# Altium schematic sheet 15 MicroSD Card.SchDoc: CM4 IO
size 297 x 209 mm; Page Create Date: March  8, 1995; Page Number: 15; Page Size: A4; Comment: radxa_1010; Page Count: 19; RevCode: V1.10; Doc: 15 MicroSD Card; DsnPath: D:\WMS\黄工\[RC126]CM4_IO_V1.10\[RC126]_V1.10\CM4 IO_V1.10.DSN; SchematicName: CM4 IO V1.10; PageName: 15 MicroSD Card; PageSize: A4; TopSchematic: True
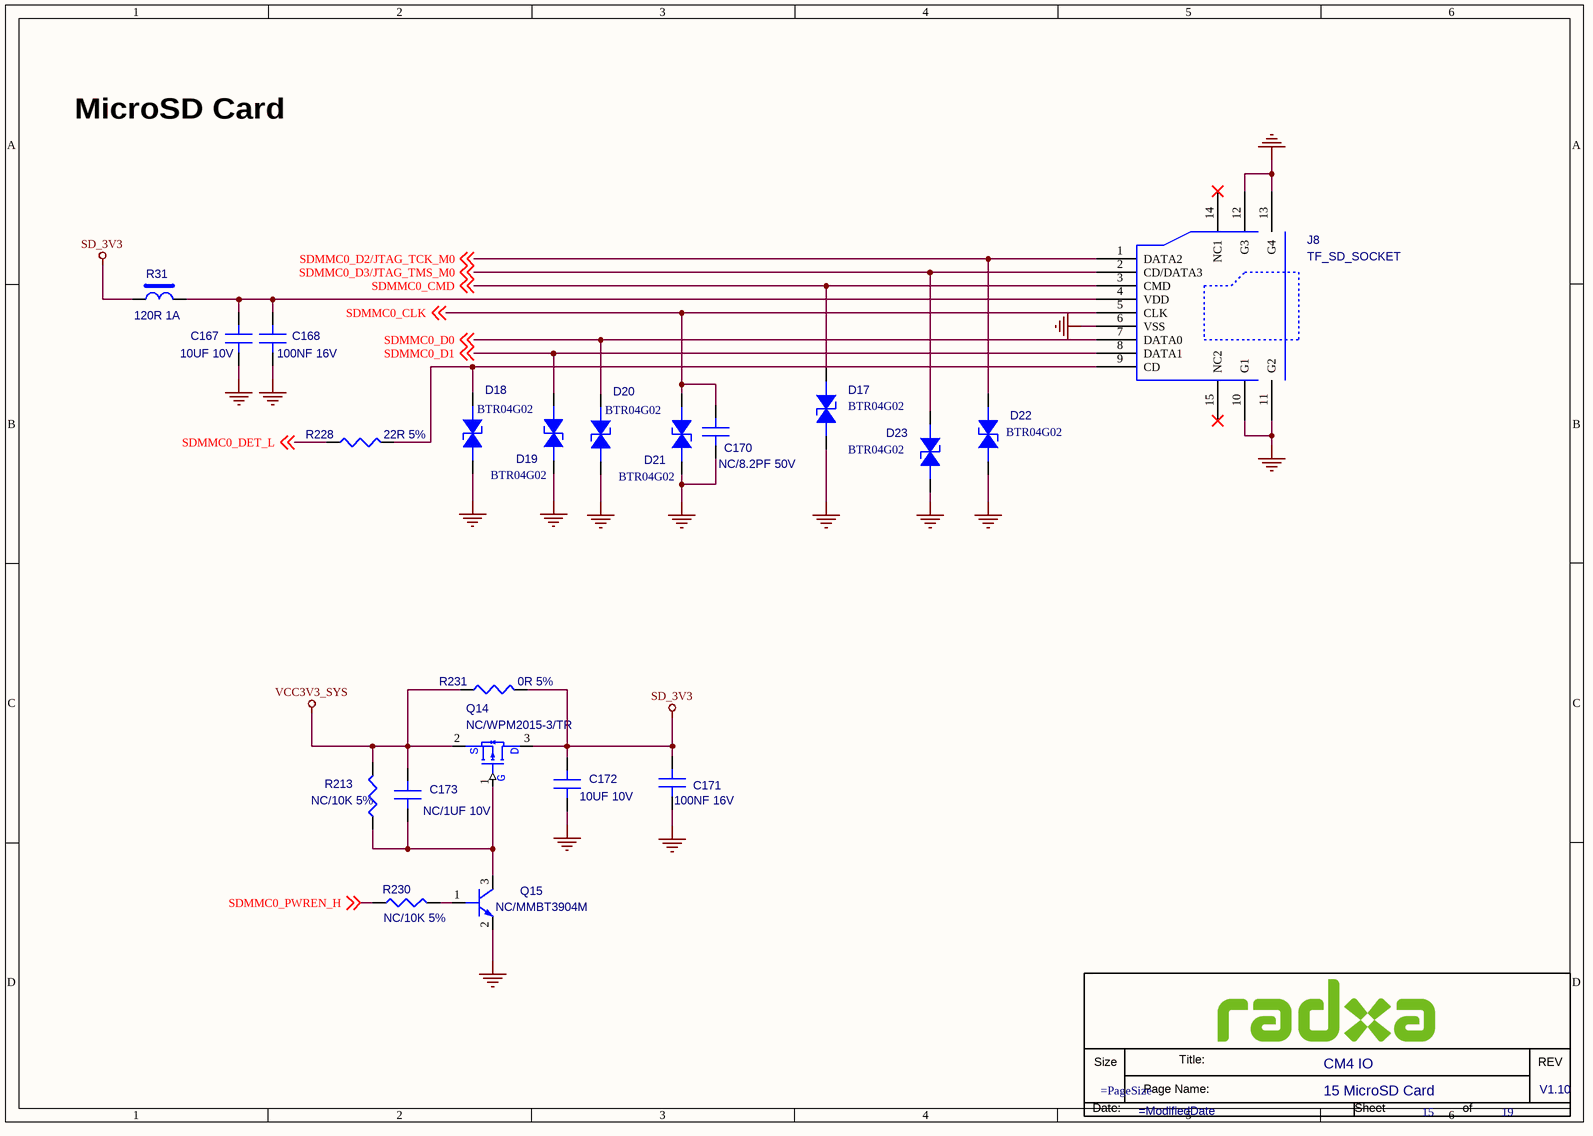
[diagram p0: 15 MicroSD Card.SchDoc]

## Parts
*  Doc: 15 MicroSD Card  RevCode: V1.10  Title: CM4 IO  Page Number: 15  Page Count: 19  (hidden comment: radxa_1010)  (graphical)
C167  10UF 10V  [C0603]
C168  100NF 16V  [C0201]
C170  NC/8.2PF 50V  [C0201]
C171  100NF 16V  [C0201]
C172  10UF 10V  [C0603]
C173  NC/1UF 10V  [C0201]
D17  BTR04G02  [DFN1006-2L]
D18  BTR04G02  [DFN1006-2L]
D19  BTR04G02  [DFN1006-2L]
D20  BTR04G02  [DFN1006-2L]
D21  BTR04G02  [DFN1006-2L]
D22  BTR04G02  [DFN1006-2L]
D23  BTR04G02  [DFN1006-2L]
J8  TF_SD_SOCKET  [SD_SM9_1D1_15D75]
Q14  NC/WPM2015-3/TR  [SOT_23]
Q15  NC/MMBT3904M  [SOT_723]
R31  120R 1A  [FB0201]
R213  NC/10K 5%  [R0402]
R228  22R 5%  [R0402]
R230  NC/10K 5%  [R0402]
R231  0R 5%  [R0402]

## Nets
GND: C167.2(B) C168.2(B) C170.2(B) C171.2(B) C172.2(B) D17.1(ANODE) D18.1(ANODE) D19.1(ANODE) D20.1(ANODE) D21.1(ANODE) D22.1(ANODE) D23.1(ANODE) J8.6(VSS) J8.10(G1) J8.11(G2) J8.12(G3) J8.13(G4) Q15.2(EMITTER)
SD_3V3: C171.1(A) C172.1(A) Q14.3(D) R31.1 R231.2
VCC3V3_SYS: C173.1(A) Q14.2(S) R213.2 R231.1
SDMMC0_CLK: C170.1(A) D21.2(CATHODE) J8.5(CLK) ; off-sheet SDMMC0_CLK
SDMMC0_CMD: D17.2(CATHODE) J8.3(CMD) ; off-sheet SDMMC0_CMD
SDMMC0_D0: D20.2(CATHODE) J8.7(DATA0) ; off-sheet SDMMC0_D0
SDMMC0_D1: D19.2(CATHODE) J8.8(DATA1) ; off-sheet SDMMC0_D1
SDMMC0_D2/JTAG_TCK_M0: D22.2(CATHODE) J8.1(DATA2) ; off-sheet SDMMC0_D2/JTAG_TCK_M0
SDMMC0_D3/JTAG_TMS_M0: D23.2(CATHODE) J8.2(CD/DATA3) ; off-sheet SDMMC0_D3/JTAG_TMS_M0
SDMMC0_DET_L: R228.1 ; off-sheet SDMMC0_DET_L
SDMMC0_PWREN_H: R230.1 ; off-sheet SDMMC0_PWREN_H
NetC167_1: C167.1(A) C168.1(A) J8.4(VDD) R31.2
NetC173_2: C173.2(B) Q14.1(G) Q15.3(COLLECTOR) R213.1
NetD18_2: D18.2(CATHODE) J8.9(CD) R228.2
NetQ15_1: Q15.1(BASE) R230.2

Not connected (* = marked no-connect by the designer): J8 14(NC1)* 15(NC2)*

## Notes on the sheet
- MicroSD Card
- (in symbol radxa_1010) Size; Title:; REV; Page Name:; Date:; Sheet; of

## Library data of the parts
C167 = C: SMD  0603  10UF  10V  X5R  ±10%  ROHS; PARTS: 1; Part Reference: C167; Part Number: A1C01.00270; OriginalSymbolOrigin: (0,30); PKG_TYPE: CAP2-100-250; LEVEL: STD; PINSWAP: (A,B); Value: 10UF 10V; Part Type: 陶瓷电容; PCB Footprint: C0603
C168 = C: SMD  0201  100NF  16V  X5R  ±20%  ROHS; PARTS: 1; Part Reference: C168; Part Number: A1C01.00099; OriginalSymbolOrigin: (0,30); PKG_TYPE: CAP2-100-250; LEVEL: STD; PINSWAP: (A,B); Preferred: 6715f349cd0bc5; Value: 100NF 16V; Part Type: 陶瓷电容
C170 = C: SMD  0201  8.2PF  50V  NPO  ±5%  ROHS; PARTS: 1; Part Reference: C170; Part Number: A1C01.00147; OriginalSymbolOrigin: (0,30); PKG_TYPE: CAP2-100-250; LEVEL: STD; PINSWAP: (A,B); Value: NC/8.2PF 50V; Part Type: 陶瓷电容; PCB Footprint: C0201
C171 = C: SMD  0201  100NF  16V  X5R  ±20%  ROHS; PARTS: 1; Part Reference: C171; Part Number: A1C01.00099; OriginalSymbolOrigin: (0,30); PKG_TYPE: CAP2-100-250; LEVEL: STD; PINSWAP: (A,B); Preferred: 6715f349cd0bc5; Value: 100NF 16V; Part Type: 陶瓷电容
C172 = C: SMD  0603  10UF  10V  X5R  ±20%  ROHS; PARTS: 1; Part Reference: C172; Part Number: A1C01.00075; OriginalSymbolOrigin: (0,30); PKG_TYPE: CAP2-100-250; LEVEL: STD; PINSWAP: (A,B); Value: 10UF 10V; PCB Footprint: C0603; Part Type: 陶瓷电容
C173 = C: SMD  0201  1UF  10V  X5R  ±20%  ROHS; PARTS: 1; Part Reference: C173; Part Number: A1C01.00081; OriginalSymbolOrigin: (0,30); PKG_TYPE: CAP2-100-250; LEVEL: STD; PINSWAP: (A,B); Value: NC/1UF 10V; PCB Footprint: C0201; Part Type: 陶瓷电容
D17 = ESD: SMD  编带  0402  BTR04G02  B-tron  ROHS; Part Reference: D17; Part Number: A1D02.00002; Parameter: ESD-台舟 ESD5341N-封装 esd0402; ID: DE-E0004; Temp Coeff: -50℃ ~ +125℃; PCB Footprint: ESD_D0402; Value: BTR04G02; Part Type: 二极管-ESD管-桥堆-TVS管
D18 = ESD: SMD  编带  0402  BTR04G02  B-tron  ROHS; Part Reference: D18; Part Number: A1D02.00002; Parameter: ESD-台舟 ESD5341N-封装 esd0402; ID: DE-E0004; Temp Coeff: -50℃ ~ +125℃; PCB Footprint: ESD_D0402; Value: BTR04G02; Part Type: 二极管-ESD管-桥堆-TVS管
D19 = ESD: SMD  编带  0402  BTR04G02  B-tron  ROHS; Part Reference: D19; Part Number: A1D02.00002; Parameter: ESD-台舟 ESD5341N-封装 esd0402; ID: DE-E0004; Temp Coeff: -50℃ ~ +125℃; PCB Footprint: ESD_D0402; Value: BTR04G02; Part Type: 二极管-ESD管-桥堆-TVS管
D20 = ESD: SMD  编带  0402  BTR04G02  B-tron  ROHS; Part Reference: D20; Part Number: A1D02.00002; Parameter: ESD-台舟 ESD5341N-封装 esd0402; ID: DE-E0004; Temp Coeff: -50℃ ~ +125℃; PCB Footprint: ESD_D0402; Value: BTR04G02; Part Type: 二极管-ESD管-桥堆-TVS管
D21 = ESD: SMD  编带  0402  BTR04G02  B-tron  ROHS; Part Reference: D21; Part Number: A1D02.00002; Parameter: ESD-台舟 ESD5341N-封装 esd0402; ID: DE-E0004; Temp Coeff: -50℃ ~ +125℃; PCB Footprint: ESD_D0402; Value: BTR04G02; Part Type: 二极管-ESD管-桥堆-TVS管
D22 = ESD: SMD  编带  0402  BTR04G02  B-tron  ROHS; Part Reference: D22; Part Number: A1D02.00002; Parameter: ESD-台舟 ESD5341N-封装 esd0402; ID: DE-E0004; Temp Coeff: -50℃ ~ +125℃; PCB Footprint: ESD_D0402; Value: BTR04G02; Part Type: 二极管-ESD管-桥堆-TVS管
D23 = ESD: SMD  编带  0402  BTR04G02  B-tron  ROHS; Part Reference: D23; Part Number: A1D02.00002; Parameter: ESD-台舟 ESD5341N-封装 esd0402; ID: DE-E0004; Temp Coeff: -50℃ ~ +125℃; PCB Footprint: ESD_D0402; Value: BTR04G02; Part Type: 二极管-ESD管-桥堆-TVS管
J8 = TF_SD_SOCKET: SMD  XKTF-N02-N  14.7*14.8*H1.95mm  9PIN  不锈钢  星坤  ROHS; Part Reference: J8; Part Number: A1J09.00014; Preferred: 6715f349cd0bc5; Temp Coeff: -30℃ to +80℃; Value: TF_SD_SOCKET; Part Type: 卡座
Q14 = MOSFET_PNP: SMD编带  SOT-23  WPM2015-3/TR  P沟道  ROHS; Part Reference: Q14; Part Number: A1D01.00019; Temp Coeff: -55℃ to ＋150℃; Value: NC/WPM2015-3/TR; Part Type: 三极管-MOS管; PCB Footprint: SOT_23
Q15 = NPN: SMD编带  SOT-723  MMBT3904M  NPN  ROHS; Part Reference: Q15; Manufacturer PN: S8050_SOT23; Manufacturer: 长电; Part Number: A1D01.00002; Pc: 0.3W; Vceo: 25V; Ic: 0.5A; Priority: A; RK PN: S8050; Temp Coeff: -55℃ to ＋150℃; PCB Footprint: SOT_723; Value: NC/MMBT3904M; Created by: JJJ; Part Type: 三极管-MOS管
R31 = BEAD: SMD  0201  FB120R  1A  MPZ0603S121HT000  ±25%  ROHS; Part Reference: R31; Part Number: A1L09.00033; PCB Footprint: FB0201; Value: 120R 1A; Part Type: 贴片磁珠
R213 = R: SMD  0201  10K  1/20W  ±5%  ROHS; Part Reference: R213; Part Number: A1R01.00012; PCB Footprint: R0201; Temp Coeff: －55℃ ~ ＋125℃; Value: NC/10K 5%; Part Type: 贴片电阻
R228 = R: SMD  0201  22R  1/20W  ±5%  ROHS; Part Reference: R228; Part Number: A1R01.00024; PCB Footprint: R0201; Temp Coeff: -55℃ to +125℃; Preferred: 6715f349cd0bc5; Value: 22R 5%; Part Type: 贴片电阻
R230 = R: SMD  0201  10K  1/20W  ±5%  ROHS; Part Reference: R230; Part Number: A1R01.00012; PCB Footprint: R0201; Temp Coeff: －55℃ ~ ＋125℃; Value: NC/10K 5%; Part Type: 贴片电阻
R231 = R: SMD  0201  0R  1/20W  ±5%  ROHS; Part Reference: R231; Part Number: A1R01.00027; PCB Footprint: R0201; Temp Coeff: -55℃ to +125℃; Preferred: 6715f349cd0bc5; Value: 0R 5%; Part Type: 贴片电阻
* = radxa_1010: Page Create Date: March  8, 1995; Page Size: =PageSize; Page Modify Date: =ModifiedDate